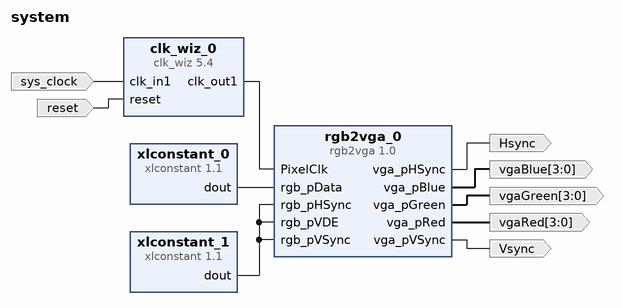
[diagram p0: block diagram of the top level]
# Vivado block design system, xc7a35tcpg236-1, Vivado 2017.4
create_bd_design system

create_bd_port -dir I -type clk sys_clock
set_property -dict {CONFIG.FREQ_HZ 100000000 CONFIG.PHASE 0.000} [get_bd_ports sys_clock]
create_bd_port -dir I -type rst reset
set_property -dict {CONFIG.POLARITY ACTIVE_HIGH} [get_bd_ports reset]
create_bd_port -dir O -from 3 -to 0 -type data vgaRed
create_bd_port -dir O -from 3 -to 0 vgaGreen
create_bd_port -dir O -from 3 -to 0 -type data vgaBlue
create_bd_port -dir O Hsync
create_bd_port -dir O Vsync

create_bd_cell -type ip -vlnv digilentinc.com:ip:rgb2vga:1.0 rgb2vga_0
set_property -dict [list \
  CONFIG.kBlueDepth 4 \
  CONFIG.kGreenDepth 4 \
  CONFIG.kRedDepth 4 \
  CONFIG.VID_IN_DATA_WIDTH 12 \
] [get_bd_cells rgb2vga_0]
create_bd_cell -type ip -vlnv xilinx.com:ip:clk_wiz:5.4 clk_wiz_0
set_property -dict [list \
  CONFIG.CLKOUT1_REQUESTED_OUT_FREQ 25 \
  CONFIG.MMCM_DIVCLK_DIVIDE 1 \
  CONFIG.MMCM_CLKFBOUT_MULT_F 9.125 \
  CONFIG.MMCM_CLKOUT0_DIVIDE_F 36.500 \
  CONFIG.USE_BOARD_FLOW true \
  CONFIG.CLK_IN1_BOARD_INTERFACE sys_clock \
  CONFIG.RESET_BOARD_INTERFACE reset \
  CONFIG.CLKOUT1_JITTER 181.828 \
  CONFIG.CLKOUT1_PHASE_ERROR 104.359 \
] [get_bd_cells clk_wiz_0]
create_bd_cell -type ip -vlnv xilinx.com:ip:xlconstant:1.1 xlconstant_0
set_property -dict {CONFIG.CONST_WIDTH 12 CONFIG.CONST_VAL 8191} [get_bd_cells xlconstant_0]
create_bd_cell -type ip -vlnv xilinx.com:ip:xlconstant:1.1 xlconstant_1

# ---- connections ----

connect_bd_net [get_bd_ports sys_clock] [get_bd_pins clk_wiz_0/clk_in1]
connect_bd_net [get_bd_ports reset] [get_bd_pins clk_wiz_0/reset]
connect_bd_net [get_bd_pins clk_wiz_0/clk_out1] [get_bd_pins rgb2vga_0/PixelClk]
connect_bd_net [get_bd_pins xlconstant_0/dout] [get_bd_pins rgb2vga_0/rgb_pData]
connect_bd_net [get_bd_pins rgb2vga_0/vga_pRed] [get_bd_ports vgaRed]
connect_bd_net [get_bd_pins rgb2vga_0/vga_pGreen] [get_bd_ports vgaGreen]
connect_bd_net [get_bd_pins xlconstant_1/dout] [get_bd_pins rgb2vga_0/rgb_pHSync] [get_bd_pins rgb2vga_0/rgb_pVSync] [get_bd_pins rgb2vga_0/rgb_pVDE]
connect_bd_net [get_bd_pins rgb2vga_0/vga_pBlue] [get_bd_ports vgaBlue]
connect_bd_net [get_bd_pins rgb2vga_0/vga_pHSync] [get_bd_ports Hsync]
connect_bd_net [get_bd_pins rgb2vga_0/vga_pVSync] [get_bd_ports Vsync]

validate_bd_design
save_bd_design
